# Altium schematic sheet Main_Schematic.SchDoc
size A4; SheetNumber: 1; SheetTotal: 5
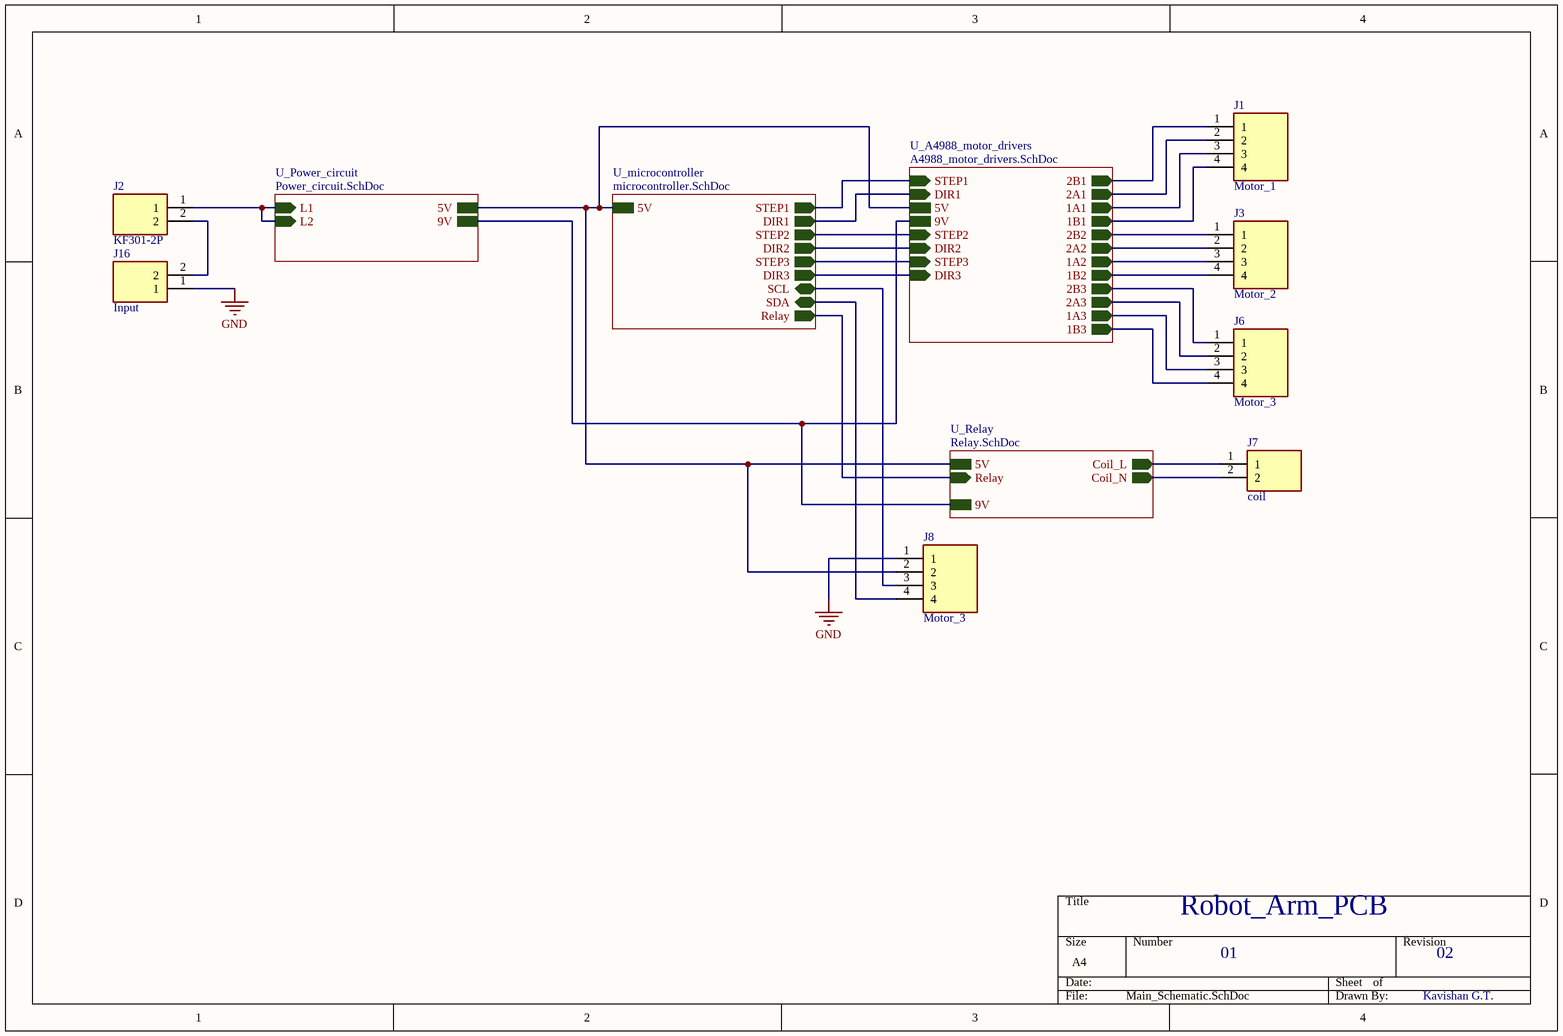
[diagram p0: Main_Schematic.SchDoc]

## Parts
J1  Motor_1  [SHDRRA4W64P0X250_1X4_1240X1150X700P]
J2  KF301-2P  [KF3012P]
J3  Motor_2  [SHDRRA4W64P0X250_1X4_1240X1150X700P]
J6  Motor_3  [SHDRRA4W64P0X250_1X4_1240X1150X700P]
J7  coil  [SHDR2W64P0X250_1X2_750X380X600P]
J8  Motor_3  [SHDRRA4W64P0X250_1X4_1240X1150X700P]
J16  Input  [SHDR2W64P0X250_1X2_750X380X600P]

## Sub-sheets
U_A4988_motor_drivers = A4988_motor_drivers.SchDoc: STEP1 (in), DIR1 (in), 2B1 (out), 2A1 (out), 1A1 (out), 1B1 (out), STEP2 (in), DIR2 (in), 2B2 (out), 2A2 (out), 1A2 (out), 1B2 (out), STEP3 (in), DIR3 (in), 2B3 (out), 2A3 (out), 1A3 (out), 1B3 (out), 5V, 9V
U_microcontroller = microcontroller.SchDoc: 5V, STEP1 (out), DIR1 (out), STEP2 (out), DIR2 (out), STEP3 (out), DIR3 (out), SCL (bidir), SDA (bidir), Relay (out)
U_Power_circuit = Power_circuit.SchDoc: L1 (in), 5V, L2 (in), 9V
U_Relay = Relay.SchDoc: Relay (in), Coil_L (out), Coil_N (out), 5V, 9V

## Nets
GND: J8.1 J16.1
NetJ1_1: J1.1 ; sheet U_A4988_motor_drivers/2B1
NetJ1_2: J1.2 ; sheet U_A4988_motor_drivers/2A1
NetJ1_3: J1.3 ; sheet U_A4988_motor_drivers/1A1
NetJ1_4: J1.4 ; sheet U_A4988_motor_drivers/1B1
NetJ2_1: J2.1 ; sheet U_Power_circuit/L1, sheet U_Power_circuit/L2
NetJ2_2: J2.2 J16.2
NetJ3_1: J3.1 ; sheet U_A4988_motor_drivers/2B2
NetJ3_2: J3.2 ; sheet U_A4988_motor_drivers/2A2
NetJ3_3: J3.3 ; sheet U_A4988_motor_drivers/1A2
NetJ3_4: J3.4 ; sheet U_A4988_motor_drivers/1B2
NetJ6_1: J6.1 ; sheet U_A4988_motor_drivers/2B3
NetJ6_2: J6.2 ; sheet U_A4988_motor_drivers/2A3
NetJ6_3: J6.3 ; sheet U_A4988_motor_drivers/1A3
NetJ6_4: J6.4 ; sheet U_A4988_motor_drivers/1B3
NetJ7_1: J7.1 ; sheet U_Relay/Coil_L
NetJ7_2: J7.2 ; sheet U_Relay/Coil_N
NetJ8_2: J8.2 ; sheet U_microcontroller/5V, sheet U_A4988_motor_drivers/5V, sheet U_Relay/5V, sheet U_Power_circuit/5V
NetJ8_3: J8.3 ; sheet U_microcontroller/SCL
NetJ8_4: J8.4 ; sheet U_microcontroller/SDA
(unnamed): sheet U_microcontroller/STEP1, sheet U_A4988_motor_drivers/STEP1
(unnamed): sheet U_microcontroller/DIR1, sheet U_A4988_motor_drivers/DIR1
(unnamed): sheet U_microcontroller/STEP2, sheet U_A4988_motor_drivers/STEP2
(unnamed): sheet U_microcontroller/DIR2, sheet U_A4988_motor_drivers/DIR2
(unnamed): sheet U_microcontroller/STEP3, sheet U_A4988_motor_drivers/STEP3
(unnamed): sheet U_microcontroller/DIR3, sheet U_A4988_motor_drivers/DIR3
(unnamed): sheet U_microcontroller/Relay, sheet U_Relay/Relay
(unnamed): sheet U_A4988_motor_drivers/9V, sheet U_Relay/9V, sheet U_Power_circuit/9V

## Notes on the sheet
- Robot_Arm_PCB
- 01
- 02
- Kavishan G.T.

## Library data of the parts
J1 J3 J6 J8 = S4B-XH-A_LF__SN_: Connector; Manufacturer_Name: JST (JAPAN SOLDERLESS TERMINALS); Manufacturer_Part_Number: S4B-XH-A(LF)(SN); Datasheet Link: http://www.jst-mfg.com/product/pdf/eng/eXH.pdf; Height: 7mm; Arrow Part Number: S4B-XH-A(LF)(SN); Arrow Price/Stock: https://www.arrow.com/en/products/s4b-xh-a-lf-sn/jst-manufacturing?region=europe
J2 = KF301-2P: Connector; Manufacturer_Name: Handson Technology; Datasheet Link: http://www.handsontec.com/dataspecs/terminal%20block-5mm.pdf; Height: 10mm; Manufacturer_Part_Number: KF301-2P
J7 J16 = B2B-EH-A: Connector; Manufacturer_Name: JST (JAPAN SOLDERLESS TERMINALS); Datasheet Link: http://www.jst-mfg.com/product/pdf/eng/eEH.pdf; Height: 6mm; Manufacturer_Part_Number: B2B-EH-A